# EasyEDA Pro project ProPrj_sx1262 125cm v0.2_2026-07-31.epro

# Schematic Schematic1
Board Name: Board1; Create Date: 2026-06-06; Page Name: P1; Project Name: sx1262 125cm; Schematic Name: Schematic1; Update Date: 2026-06-07; Company: EasyEDA.com; Page Size: A4; Version: V1.0
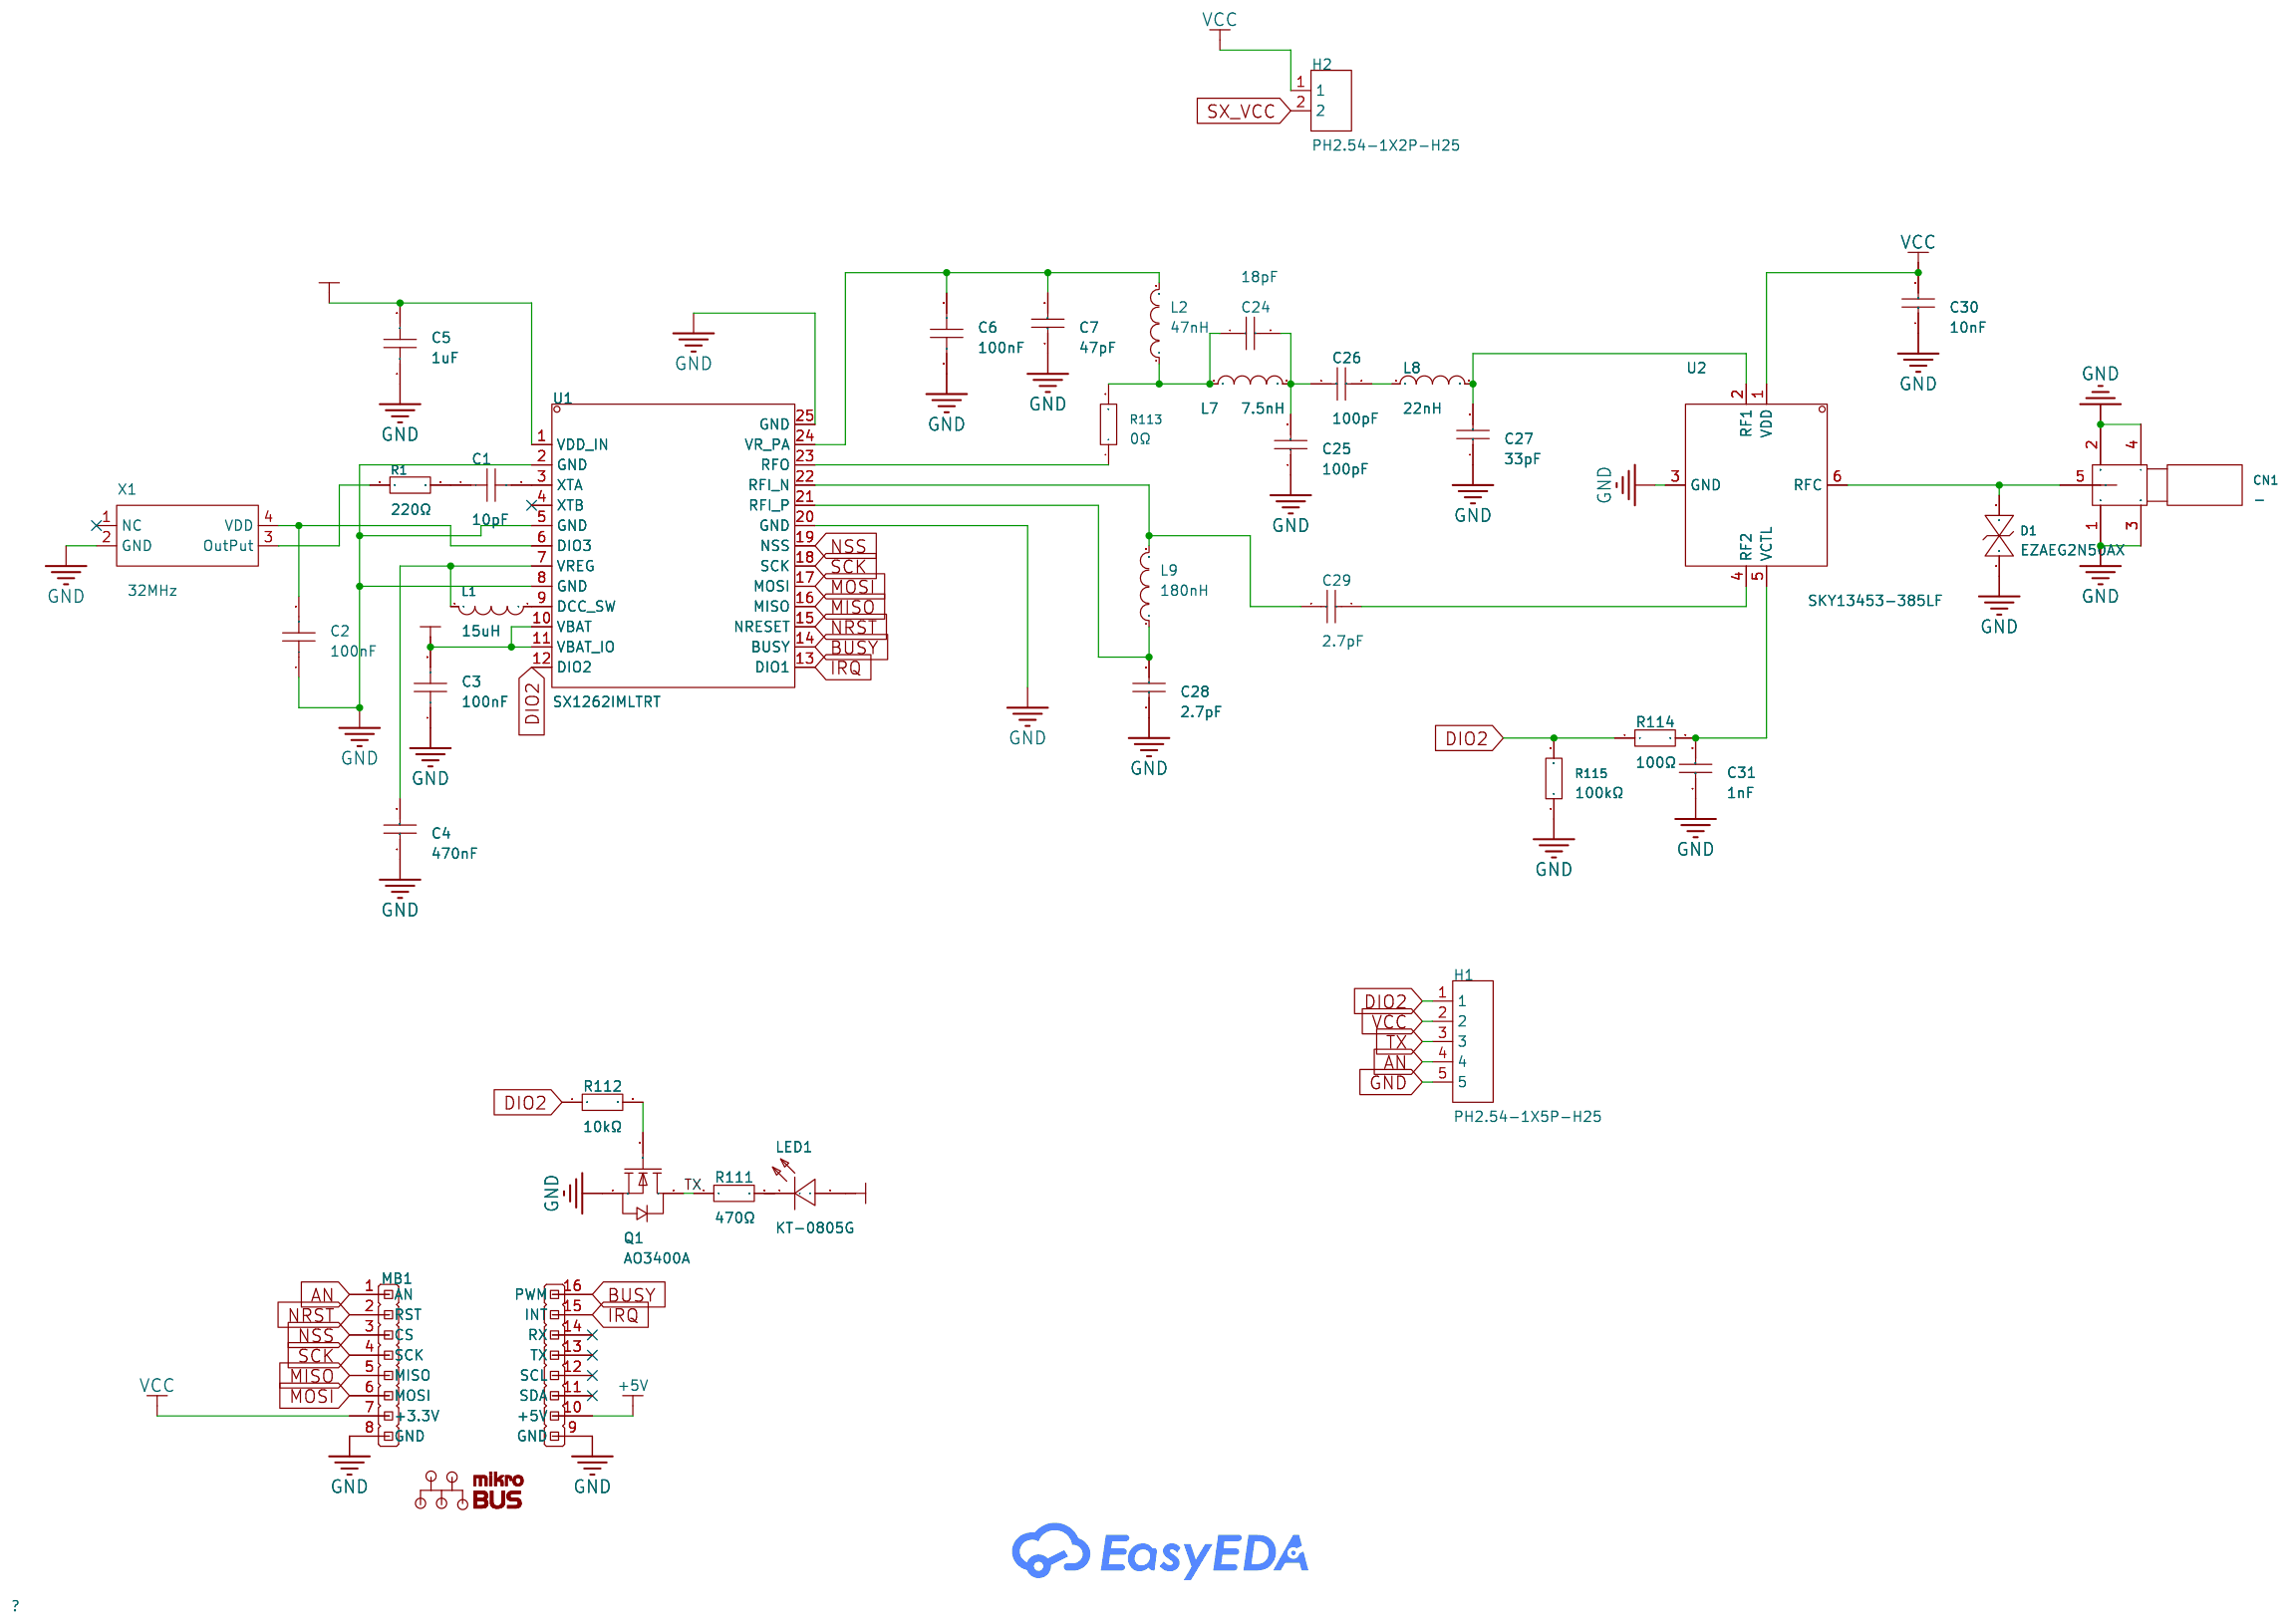
[diagram p0: schematic sheet]

## Parts
C1  10pF  [C0402]
C2  100nF  [C0402]
C3  100nF  [C0402]
C4  470nF  [C0603]
C5  1uF  [C0402]
C6  100nF  [C0402]
C7  47pF  [C0402]
C24  18pF  [C0402]
C25  100pF  [C0402]
C26  100pF  [C0402]
C27  33pF  [C0402]
C28  2.7pF  [C0402]
C29  2.7pF  [C0402]
C30  10nF  [C0402]
C31  1nF  [C0402]
CN1  -  [CONN-SMD_KH-SMA-KE8-G]
D1  EZAEG2N50AX  [D0402-BI]
H1  PH2.54-1X5P-H25  [HDR-TH_5P-P2.54-V-M-3]  (no BOM)
H2  PH2.54-1X2P-H25  [HDR-TH_2P-P2.54-V-M-4]  (no BOM)
L1  15uH  [L0805]
L2  47nH  [IND-SMD_L1.2-W0.6-1]
L7  7.5nH  [L0402]
L8  22nH  [L0402]
L9  180nH  [L0402-RD]
LED1  KT-0805G  [LED0805-R-RD]
MB1  -  [mikroBUS add-on Board]
Q1  AO3400A  [SOT-23-3_L2.9-W1.3-P1.90-LS2.4-BR]
R1  220Ω  [R0402]
R111  470Ω  [R0402]
R112  10kΩ  [R0402]
R113  0Ω  [R0402]
R114  100Ω  [R0402]
R115  100kΩ  [R0402]
U1  SX1262IMLTRT  [QFN-24_L4.0-W4.0-P0.50-BL-EP2.6]
U2  SKY13453-385LF  [QFN-6_L1.0-W1.0-P0.50-LS1.0-BL]
X1  32MHz  [OSC-SMD_4P-L2.0-W1.6-BL_1]

## Library data of the parts
C1 = CL05C100JB5NNNC: Capacitance:10pF Tolerance:±5% Tolerance:±5% Voltage Rating:50V Temperature Coefficient:C0G; LCSC Part Name: 10pF ±5% 50V; Supplier Part: C32949; Manufacturer: SAMSUNG(三星); Supplier Footprint: 0402; JLCPCB Part Class: Basic Part; Datasheet: https://item.szlcsc.com/datasheet/CL05C100JB5NNNC/33914.html; Supplier: LCSC; Tolerance: ±5%; Voltage Rating: 50V; Temperature Coefficient: C0G
C2 C3 C6 = CL05B104KO5NNNC: Capacitance:100nF Tolerance:±10% Tolerance:±10% Voltage Rating:16V Temperature Coefficient:X7R; LCSC Part Name: 100nF ±10% 16V; Supplier Part: C1525; Manufacturer: SAMSUNG(三星); Supplier Footprint: 0402; JLCPCB Part Class: Basic Part; Datasheet: https://item.szlcsc.com/datasheet/CL05B104KO5NNNC/1877.html; Supplier: LCSC; Tolerance: ±10%; Voltage Rating: 16V; Temperature Coefficient: X7R
C4 = CL10B474KA8NNNC: Capacitance:470nF Tolerance:±10% Tolerance:±10% Voltage Rating:25V Temperature Coefficient:X7R; LCSC Part Name: 470nF ±10% 25V; Supplier Part: C1623; Manufacturer: SAMSUNG(三星); Supplier Footprint: 0603; JLCPCB Part Class: Basic Part; Datasheet: https://item.szlcsc.com/datasheet/CL10B474KA8NNNC/1975.html; Supplier: LCSC; Tolerance: ±10%; Voltage Rating: 25V; Temperature Coefficient: X7R
C5 = CL05A105KA5NQNC: Capacitance:1uF Tolerance:±10% Tolerance:±10% Voltage Rating:25V Temperature Coefficient:X5R; LCSC Part Name: 1uF ±10% 25V; Supplier Part: C52923; Manufacturer: SAMSUNG(三星); Supplier Footprint: 0402; JLCPCB Part Class: Basic Part; Datasheet: https://item.szlcsc.com/datasheet/CL05A105KA5NQNC/53938.html; Supplier: LCSC; Tolerance: ±10%; Voltage Rating: 25V; Temperature Coefficient: X5R
C7 = 0402CG470J500NT: Capacitance:47pF Tolerance:±5% Tolerance:±5% Voltage Rating:50V Temperature Coefficient:C0G; LCSC Part Name: 47pF ±5% 50V; Supplier Part: C1567; Manufacturer: FH(风华); Supplier Footprint: 0402; JLCPCB Part Class: Basic Part; Datasheet: https://item.szlcsc.com/datasheet/0402CG470J500NT/1919.html; Supplier: LCSC; Tolerance: ±5%; Voltage Rating: 50V; Temperature Coefficient: C0G
C24 = 0402CG180J500NT: Capacitance:18pF Tolerance:±5% Tolerance:±5% Voltage Rating:50V Temperature Coefficient:C0G; LCSC Part Name: 18pF ±5% 50V; Supplier Part: C1549; Manufacturer: FH(风华); Supplier Footprint: 0402; JLCPCB Part Class: Basic Part; Datasheet: https://item.szlcsc.com/datasheet/0402CG180J500NT/1901.html; Supplier: LCSC; Tolerance: ±5%; Voltage Rating: 50V; Temperature Coefficient: C0G
C25 C26 = 0402CG101J500NT: Capacitance:100pF Tolerance:±5% Tolerance:±5% Voltage Rating:50V Temperature Coefficient:C0G; LCSC Part Name: 100pF ±5% 50V; Supplier Part: C1546; Manufacturer: FH(风华); Supplier Footprint: 0402; JLCPCB Part Class: Basic Part; Datasheet: https://item.szlcsc.com/datasheet/0402CG101J500NT/1898.html; Supplier: LCSC; Tolerance: ±5%; Voltage Rating: 50V; Temperature Coefficient: C0G
C27 = 0402CG330J500NT: Capacitance:33pF Tolerance:±5% Tolerance:±5% Voltage Rating:50V Temperature Coefficient:C0G; LCSC Part Name: 33pF ±5% 50V; Supplier Part: C1562; Manufacturer: FH(风华); Supplier Footprint: 0402; JLCPCB Part Class: Basic Part; Datasheet: https://item.szlcsc.com/datasheet/0402CG330J500NT/1914.html; Supplier: LCSC; Tolerance: ±5%; Voltage Rating: 50V; Temperature Coefficient: C0G
C28 C29 = 0402CG2R7C500NT: Capacitance:2.7pF Voltage Rating:50V Temperature Coefficient:C0G; LCSC Part Name: ±0.25pF 2.7pF 50V; Supplier Part: C1561; Manufacturer: FH(风华); Supplier Footprint: 0402; JLCPCB Part Class: Extended Part; Datasheet: https://item.szlcsc.com/datasheet/0402CG2R7C500NT/1913.html; Supplier: LCSC; Voltage Rating: 50V; Temperature Coefficient: C0G
C30 = CL05B103KB5NNNC: Capacitance:10nF Tolerance:±10% Tolerance:±10% Voltage Rating:50V Temperature Coefficient:X7R; LCSC Part Name: 10nF ±10% 50V; Supplier Part: C15195; Manufacturer: SAMSUNG(三星); Supplier Footprint: 0402; JLCPCB Part Class: Basic Part; Datasheet: https://item.szlcsc.com/datasheet/CL05B103KB5NNNC/15869.html; Supplier: LCSC; Tolerance: ±10%; Voltage Rating: 50V; Temperature Coefficient: X7R
C31 = 0402B102K500NT: Capacitance:1nF Tolerance:±10% Tolerance:±10% Voltage Rating:50V Temperature Coefficient:X7R; LCSC Part Name: 1nF ±10% 50V; Supplier Part: C1523; Manufacturer: FH(风华); Supplier Footprint: 0402; JLCPCB Part Class: Basic Part; Datasheet: https://item.szlcsc.com/datasheet/0402B102K500NT/1875.html; Supplier: LCSC; Tolerance: ±10%; Voltage Rating: 50V; Temperature Coefficient: X7R
CN1 = KH-SMA-KE8-G: Connector Type:Board Side Interface:Inner Bore Number of Ports:1 Interface Diameter:- Interface Length/Height:8mm Frequency:- RF Series:SMA Impedance:- Style:Offset Pin Operating Temperature Range:- Operating Temperature Range:-; LCSC Part Name: 内孔 SMA 偏脚; Supplier Part: C530661; Manufacturer: kinghelm(金航标); Supplier Footprint: 插件; JLCPCB Part Class: Extended Part; Datasheet: https://item.szlcsc.com/datasheet/KH-SMA-KE8-G/550995.html; Supplier: LCSC; Connector Type: Board Side; Interface: Inner Bore; Number of Ports: 1; Interface Length/Height: 8mm; RF Series: SMA; Style: Offset Pin
D1 = EZAEG2N50AX: Reverse Stand-Off Voltage (Vrwm):30V Clamping Voltage:100V Reverse Leakage Current (Ir):1mA Operating Temperature:-55℃~+125℃ Operating Temperature:-55℃~+125℃ level of protection:IEC 61000-4-2 Type:ESD Junction Capacitance:0.05pF; Supplier Part: C543662; Manufacturer: PANASONIC(松下); Supplier Footprint: 0402; JLCPCB Part Class: Extended Part; Datasheet: https://item.szlcsc.com/datasheet/EZAEG2N50AX/564298.html; Supplier: LCSC; Reverse Stand-Off Voltage (Vrwm): 30V; Clamping Voltage: 100V; Reverse Leakage Current (Ir): 1mA; Operating Temperature: -55℃~+125℃; level of protection: IEC 61000-4-2; Type: ESD; Junction Capacitance: 0.05pF
H1 = PH2.54-1X5P-H25: Pin Structure:1x5P Pitch:2.54mm Row Spacing:- Circluar Pins/Square Pins:Pin Header Mounting Type:Through Hole Number of Rows:1 Number of Pins:5P Current Rating:3A Voltage Rating (Max):- Length of Mating Pin:6mm Insulation Height:2.5mm Length of End Connec; LCSC Part Name: 1x5P 间距:2.54mm 方针 直插; Supplier Part: C42431835; Manufacturer: JXTCONN(聚兴泰); Supplier Footprint: 插件,P=2.54mm; JLCPCB Part Class: Extended Part; Datasheet: https://item.szlcsc.com/datasheet/PH2.54-1X5P-H25/44458965.html; Supplier: LCSC; Pin Structure: 1x5P; Pitch: 2.54mm; Circluar Pins/Square Pins: Pin Header; Mounting Type: Through Hole; Number of Rows: 1; Number of Pins: 5P; Current Rating: 3A; Length of Mating Pin: 6mm; Insulation Height: 2.5mm; Length of End Connection Pin: 3mm; Contact Material: Brass; Contact Plating: Gold; Operating Temperature: -40℃~+105℃; Color: Black
H2 = PH2.54-1X2P-H25: Pin Structure:1x2P Pitch:2.54mm Row Spacing:- Circluar Pins/Square Pins:Pin Header Mounting Type:Through Hole Number of Rows:1 Number of Pins:2P Current Rating:3A Voltage Rating (Max):- Length of Mating Pin:6mm Insulation Height:2.5mm Length of End Connec; LCSC Part Name: 1x2P 间距:2.54mm 方针 直插; Supplier Part: C42431798; Manufacturer: JXTCONN(聚兴泰); Supplier Footprint: 插件,P=2.54mm; JLCPCB Part Class: Extended Part; Datasheet: https://item.szlcsc.com/datasheet/PH2.54-1X2P-H25/44458928.html; Supplier: LCSC; Pin Structure: 1x2P; Pitch: 2.54mm; Circluar Pins/Square Pins: Pin Header; Mounting Type: Through Hole; Number of Rows: 1; Number of Pins: 2P; Current Rating: 3A; Length of Mating Pin: 6mm; Insulation Height: 2.5mm; Length of End Connection Pin: 3mm; Contact Material: Brass; Contact Plating: Gold; Operating Temperature: -40℃~+105℃; Color: Black
L1 = MLZ2012M150WT000: Inductance:15uH Tolerance:±20% Tolerance:±20% Current Rating:- Current - Saturation (Isat):120mA DC Resistance(DCR):950mΩ Q @ Frequency:- Frequency - Self Resonant:2MHz Ratings:-; LCSC Part Name: 15uH ±20% 120mA; Supplier Part: C383402; Manufacturer: TDK; Supplier Footprint: 0805; JLCPCB Part Class: Extended Part; Datasheet: https://item.szlcsc.com/datasheet/MLZ2012M150WT000/356709.html; Supplier: LCSC; Tolerance: ±20%; Current - Saturation (Isat): 120mA; DC Resistance(DCR): 950mΩ; Frequency - Self Resonant: 2MHz
L2 = SCW1005C47NJST: Inductance:47nH Tolerance:±5% Tolerance:±5% Current Rating:200mA Current - Saturation (Isat):- DC Resistance(DCR):950mΩ Q @ Frequency:25@250MHz Frequency - Self Resonant:2.9GHz Ratings:- Type:Wire-wound chip inductor; LCSC Part Name: 47nH ±5%; Supplier Part: C330871; Manufacturer: Sunltech(顺磁); Supplier Footprint: 0402; JLCPCB Part Class: Extended Part; Datasheet: https://item.szlcsc.com/datasheet/SCW1005C47NJST/310273.html; Supplier: LCSC; Tolerance: ±5%; Current Rating: 200mA; DC Resistance(DCR): 950mΩ; Q @ Frequency: 25@250MHz; Frequency - Self Resonant: 2.9GHz; Type: Wire-wound chip inductor
L7 = LQG15HS7N5J02D: Inductance:7.5nH Tolerance:±5% Tolerance:±5% Current Rating:550mA Current - Saturation (Isat):- DC Resistance(DCR):240mΩ Q @ Frequency:8@100MHz Frequency - Self Resonant:4.2GHz Ratings:-; LCSC Part Name: 7.5nH ±5%; Supplier Part: C98001; Manufacturer: muRata(村田); Supplier Footprint: 0402; JLCPCB Part Class: Extended Part; Datasheet: https://item.szlcsc.com/datasheet/LQG15HS7N5J02D/99210.html; Supplier: LCSC; Tolerance: ±5%; Current Rating: 550mA; DC Resistance(DCR): 240mΩ; Q @ Frequency: 8@100MHz; Frequency - Self Resonant: 4.2GHz
L8 = SCW1005C22NJST: Inductance:22nH Tolerance:±5% Tolerance:±5% Current Rating:330mA Current - Saturation (Isat):- DC Resistance(DCR):360mΩ Q @ Frequency:25@250MHz Frequency - Self Resonant:4GHz Ratings:- Type:Wire-wound chip inductor; LCSC Part Name: 22nH ±5%; Supplier Part: C330861; Manufacturer: Sunltech(顺磁); Supplier Footprint: 0402; JLCPCB Part Class: Extended Part; Datasheet: https://item.szlcsc.com/datasheet/SCW1005C22NJST/310263.html; Supplier: LCSC; Tolerance: ±5%; Current Rating: 330mA; DC Resistance(DCR): 360mΩ; Q @ Frequency: 25@250MHz; Frequency - Self Resonant: 4GHz; Type: Wire-wound chip inductor
L9 = MLG1005SR18JTD25: Inductance: Tolerance:±5% Tolerance:±5% Rated Current: Saturation Current (Isat):- DC Resistance (DCR): Q @ Freq:8@100MHz Frequency - Self Resonant: Ratings:AEC-Q200; LCSC Part Name: 180nH ±5%; Supplier Part: C694570; Manufacturer: TDK; Supplier Footprint: 0402; JLCPCB Part Class: Extended Part; Datasheet: https://atta.szlcsc.com/upload/public/pdf/source/20210429/EF7AC43F62BD048FB58613B8084F8FDA.pdf; Supplier: LCSC; Tolerance: ±5%; Q @ Freq: 8@100MHz; Ratings: AEC-Q200
LED1 = KT-0805G: Lamp Holder Type:- Illumination Color:Emerald Green Voltage - Forward(Vf):2.6V~3.1V Voltage - Forward(Vf):2.6V~3.1V Power(Watts):100mW Forward Current:5mA Wavelength - Dominant:513nm~528nm Wavelength - Dominant:513nm~528nm Peak Wavelength:525nm Diode Conf; LCSC Part Name: 0805 翠绿 高亮; Supplier Part: C2297; Manufacturer: KENTO; Supplier Footprint: 0805; JLCPCB Part Class: Basic Part; Datasheet: https://item.szlcsc.com/datasheet/KT-0805G/2670.html; Supplier: LCSC; Illumination Color: Emerald Green; Voltage - Forward(Vf): 2.6V~3.1V; Power(Watts): 100mW; Forward Current: 5mA; Wavelength - Dominant: 513nm~528nm; Peak Wavelength: 525nm; Diode Configuration: Discrete Diode; Lens Color: Water Clear; Luminous Intensity: 430mcd; Viewing Angle: 120°; Operating Temperature: -40℃~+85℃
MB1 = mikroBUS: ClickBoard
Q1 = AO3400A_C20917: Number:- Drain to Source Voltage:30V Current - Continuous Drain(Id):- RDS(on):48mΩ@2.5V Pd - Power Dissipation:- Gate Threshold Voltage (Vgs(th)):1.45V@250uA Gate Charge(Qg):7nC@10V Input Capacitance(Ciss):630pF@15V Reverse Transfer Capacitance (Crss@Vds); LCSC Part Name: 1个N沟道 耐压:30V 电流:5.7A; Supplier Part: C20917; Manufacturer: AOS; Supplier Footprint: SOT-23-3L; JLCPCB Part Class: Basic Part; Datasheet: https://item.szlcsc.com/datasheet/AO3400A/21629.html; Supplier: LCSC; Drain to Source Voltage: 30V; RDS(on): 48mΩ@2.5V; Gate Threshold Voltage (Vgs(th)): 1.45V@250uA; Gate Charge(Qg): 7nC@10V; Input Capacitance(Ciss): 630pF@15V; Operating Temperature: -55℃~+150℃@(Tj); Type: N-Channel
R1 = 0402WGF2200TCE: Type:Thick Film Resistor Resistance:220Ω Tolerance:±1% Tolerance:±1% Power(Watts):62.5mW Voltage-Supply(Max):50V Temperature Coefficient:±100ppm/℃ Temperature Coefficient:±100ppm/℃ Operating Temperature:-55℃~+155℃ Operating Temperature:-55℃~+155℃; LCSC Part Name: 220Ω ±1% 62.5mW 厚膜电阻; Supplier Part: C25091; Manufacturer: UNI-ROYAL(厚声); Supplier Footprint: 0402; JLCPCB Part Class: Basic Part; Datasheet: https://item.szlcsc.com/datasheet/0402WGF2200TCE/25834.html; Supplier: LCSC; Type: Thick Film Resistor; Tolerance: ±1%; Power(Watts): 62.5mW; Voltage-Supply(Max): 50V; Temperature Coefficient: ±100ppm/℃; Operating Temperature: -55℃~+155℃
R111 = 0402WGF4700TCE: Type:Thick Film Resistor Resistance:470Ω Tolerance:±1% Tolerance:±1% Power(Watts):62.5mW Voltage-Supply(Max):50V Temperature Coefficient:±100ppm/℃ Temperature Coefficient:±100ppm/℃ Operating Temperature:-55℃~+155℃ Operating Temperature:-55℃~+155℃; LCSC Part Name: 470Ω ±1% 62.5mW 厚膜电阻; Supplier Part: C25117; Manufacturer: UNI-ROYAL(厚声); Supplier Footprint: 0402; JLCPCB Part Class: Basic Part; Datasheet: https://item.szlcsc.com/datasheet/0402WGF4700TCE/25860.html; Supplier: LCSC; Type: Thick Film Resistor; Tolerance: ±1%; Power(Watts): 62.5mW; Voltage-Supply(Max): 50V; Temperature Coefficient: ±100ppm/℃; Operating Temperature: -55℃~+155℃
R112 = 0402WGF1002TCE: Type:Thick Film Resistor Resistance:10kΩ Tolerance:±1% Tolerance:±1% Power(Watts):62.5mW Voltage-Supply(Max):50V Temperature Coefficient:±100ppm/℃ Temperature Coefficient:±100ppm/℃ Operating Temperature:-55℃~+155℃ Operating Temperature:-55℃~+155℃; LCSC Part Name: 10kΩ ±1% 62.5mW 厚膜电阻; Supplier Part: C25744; Manufacturer: UNI-ROYAL(厚声); Supplier Footprint: 0402; JLCPCB Part Class: Basic Part; Datasheet: https://item.szlcsc.com/datasheet/0402WGF1002TCE/26487.html; Supplier: LCSC; Type: Thick Film Resistor; Tolerance: ±1%; Power(Watts): 62.5mW; Voltage-Supply(Max): 50V; Temperature Coefficient: ±100ppm/℃; Operating Temperature: -55℃~+155℃
R113 = 0402WGF0000TCE: Type:Thick Film Resistor Resistance:0Ω Tolerance:±1% Tolerance:±1% Power(Watts):62.5mW Voltage-Supply(Max):50V Temperature Coefficient:±800ppm/℃ Temperature Coefficient:±800ppm/℃ Operating Temperature:-55℃~+155℃ Operating Temperature:-55℃~+155℃; LCSC Part Name: 0Ω ±1% 62.5mW 厚膜电阻; Supplier Part: C17168; Manufacturer: UNI-ROYAL(厚声); Supplier Footprint: 0402; JLCPCB Part Class: Basic Part; Datasheet: https://item.szlcsc.com/datasheet/0402WGF0000TCE/17853.html; Supplier: LCSC; Type: Thick Film Resistor; Tolerance: ±1%; Power(Watts): 62.5mW; Voltage-Supply(Max): 50V; Temperature Coefficient: ±800ppm/℃; Operating Temperature: -55℃~+155℃
R114 = 0402WGF1000TCE: Type:Thick Film Resistors Resistance: Tolerance:±1% Tolerance:±1% Power(Watts): Overload Voltage (Max): Temperature Coefficient:±200ppm/℃ Temperature Coefficient:±200ppm/℃ Operating Temperature Range:-55℃~+155℃ Operating Temperature Range:-55℃~+155℃; LCSC Part Name: 100Ω ±1% 62.5mW 厚膜电阻; Supplier Part: C25076; Manufacturer: UNI-ROYAL(厚声); Supplier Footprint: 0402; JLCPCB Part Class: Basic Part; Datasheet: https://atta.szlcsc.com/upload/public/pdf/source/20200306/C422600_1E6D84923E4A46A82E41ADD87F860B5C.pdf; Supplier: LCSC; Type: Thick Film Resistors; Tolerance: ±1%; Temperature Coefficient: ±200ppm/℃; Operating Temperature Range: -55℃~+155℃
R115 = 0402WGF1003TCE: Type:Thick Film Resistor Resistance:100kΩ Tolerance:±1% Tolerance:±1% Power(Watts):62.5mW Voltage-Supply(Max):50V Temperature Coefficient:±100ppm/℃ Temperature Coefficient:±100ppm/℃ Operating Temperature:-55℃~+155℃ Operating Temperature:-55℃~+155℃; LCSC Part Name: 100kΩ ±1% 62.5mW 厚膜电阻; Supplier Part: C25741; Manufacturer: UNI-ROYAL(厚声); Supplier Footprint: 0402; JLCPCB Part Class: Basic Part; Datasheet: https://item.szlcsc.com/datasheet/0402WGF1003TCE/26484.html; Supplier: LCSC; Type: Thick Film Resistor; Tolerance: ±1%; Power(Watts): 62.5mW; Voltage-Supply(Max): 50V; Temperature Coefficient: ±100ppm/℃; Operating Temperature: -55℃~+155℃
U1 = SX1262IMLTRT: Frequency Range:- Frequency Range:- Interface:SPI Voltage - Supply:1.8V~3.7V Voltage - Supply:1.8V~3.7V Applications:General-purposeISM Output Power:22dBm Data Rate:300Kbps Current Of Transmitting:32mA Sensitivity:-148dBm Receive Current:4.2mA Operating T; Supplier Part: C191341; Manufacturer: SEMTECH; Supplier Footprint: QFN-24-EP(4x4); JLCPCB Part Class: Extended Part; Datasheet: https://item.szlcsc.com/datasheet/SX1262IMLTRT/216566.html; Supplier: LCSC; Interface: SPI; Voltage - Supply: 1.8V~3.7V; Applications: General-purposeISM; Output Power: 22dBm; Data Rate: 300Kbps; Current Of Transmitting: 32mA; Sensitivity: -148dBm; Receive Current: 4.2mA; Operating Temperature: -40℃~+85℃
U2 = SKY13453-385LF: Circuit:SPDT Frequency range:10MHz~6GHz Frequency range:10MHz~6GHz isolation:27dB Insertion loss:0.4dB P1dB:- Voltage - Supply:2.5V~3.5V Voltage - Supply:2.5V~3.5V operating temperature:-40℃~+90℃ operating temperature:-40℃~+90℃ Features:Integrated control; LCSC Part Name: 0.01至6.0GHz单控制SPDT射频开关; Supplier Part: C150878; Manufacturer: SKYWORKS; Supplier Footprint: QFN-6(1x1); JLCPCB Part Class: Extended Part; Datasheet: https://item.szlcsc.com/datasheet/SKY13453-385LF/162218.html; Supplier: LCSC; Circuit: SPDT; Frequency range: 10MHz~6GHz; isolation: 27dB; Insertion loss: 0.4dB; Voltage - Supply: 2.5V~3.5V; operating temperature: -40℃~+90℃; Features: Integrated control logic
X1 = OW7EL89CANUXK7YLC-32M: Frequency:32MHz Frequency Stability:±500ppb Frequency Stability:±500ppb Output Type:Clipped sine wave Voltage - Supply:1.8V Voltage - Supply:1.8V Current - Supply:- Operating Temperature:-30℃~+85℃ Operating Temperature:-30℃~+85℃ Ratings:-; LCSC Part Name: YSO510TP 32MHZ 1.8V ±1.5PPM -30~85℃ (±0.5PPM) Clipped Sine Wave; Supplier Part: C48332759; Manufacturer: YXC(扬兴晶振); Supplier Footprint: SMD2016-4P; JLCPCB Part Class: Extended Part; Datasheet: https://item.szlcsc.com/datasheet/OW7EL89CANUXK7YLC-32M/50580117.html; Supplier: LCSC; Frequency Stability: ±500ppb; Output Type: Clipped sine wave; Voltage - Supply: 1.8V; Operating Temperature: -30℃~+85℃

## Nets
+5V: MB1.10(+5V)
GND: C2.1 C3.1 C4.1 C5.1 C6.1 C7.1 C25.1 C27.1 C28.1 C30.1 C31.1 CN1.1 CN1.2 CN1.3 CN1.4 D1.1 H1.5 MB1.8(GND) MB1.9(GND) Q1.2(S) R115.1 U1.2(GND) U1.5(GND) U1.8(GND) U1.20(GND) U1.25(GND) U2.3(GND) X1.2(GND)
VCC: C30.2 H1.2 H2.1 LED1.1(A) MB1.7(+3.3V) U2.1(VDD)
AN: H1.4 MB1.1(AN)
BUSY: MB1.16(PWM) U1.14(BUSY)
DIO2: H1.1 R112.1 R114.1 R115.2 U1.12(DIO2)
IRQ: MB1.15(INT) U1.13(DIO1)
MISO: MB1.5(MISO) U1.16(MISO)
MOSI: MB1.6(MOSI) U1.17(MOSI)
NRST: MB1.2(RST) U1.15(NRESET)
NSS: MB1.3(CS) U1.19(NSS)
SCK: MB1.4(SCK) U1.18(SCK)
SX_VCC: C3.2 C5.2 H2.2 U1.1(VDD_IN) U1.10(VBAT) U1.11(VBAT_IO)
TX: H1.3 Q1.3(D) R111.1
$1N896: C1.2 U1.3(XTA)
$1N969: C1.1 R1.2
$1N1011: C2.2 U1.6(DIO3) X1.4(VDD)
$1N1017: R1.1 X1.3(OutPut)
$1N1388: C4.2 L1.2 U1.7(VREG)
$1N1396: L1.1 U1.9(DCC_SW)
$1N1923: C6.2 C7.2 L2.2 U1.24(VR_PA)
$1N2924: C29.2 L9.2 U1.22(RFI_N)
$1N3047: C28.2 L9.1 U1.21(RFI_P)
$1N4328: LED1.2(K) R111.2
$1N4330: Q1.1(G) R112.2
$1N8839: R113.1 U1.23(RFO)
$1N8844: C24.1 L2.1 L7.1 R113.2
$1N12166: C24.2 C25.2 C26.1 L7.2
$1N12308: C26.2 L8.1
$1N12515: CN1.5 D1.2 U2.6(RFC)
$1N13592: C31.2 R114.2 U2.5(VCTL)
$1N13617: C27.2 L8.2 U2.2(RF1)
$1N13621: C29.1 U2.4(RF2)

Not connected (* = marked no-connect by the designer): MB1 11(SDA)* 12(SCL)* 13(TX)* 14(RX)*; U1 4(XTB)*; X1 1(NC)*

# Board PCB1
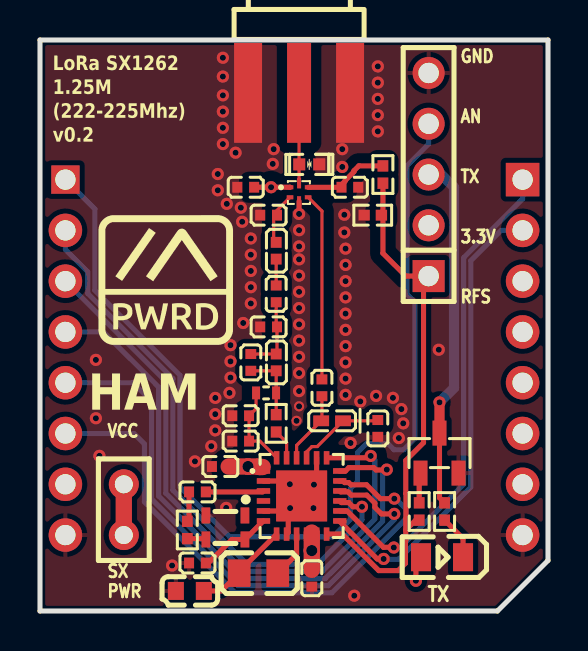
[diagram p1: board, top side]
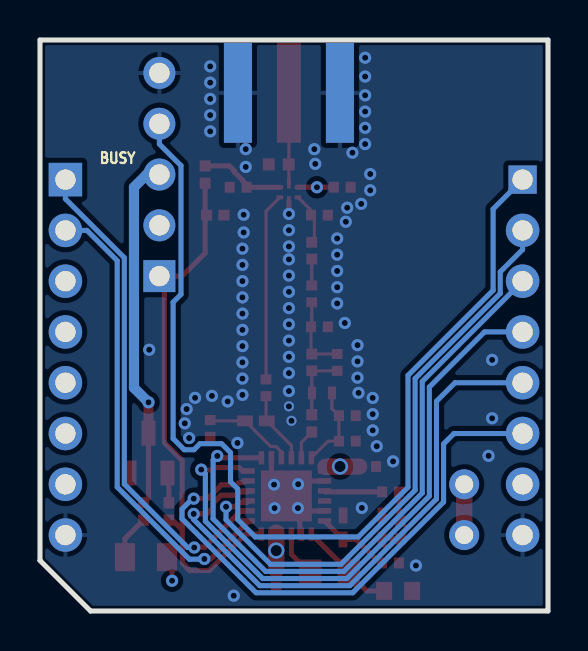
[diagram p2: board, bottom side, seen from below]

Outline 25.4 x 28.56 mm; copper layers: Top Layer, Inner1, Inner2, Bottom Layer. Coordinates in mm from the lower left corner of the outline.
Outline path: 0,28.56 25.4,28.56 25.4,2.53 22.87,0 0,0 0,28.56
Stack: Top Layer 0.035mm Outer layer thickness 1oz / Dielectric1 0.2104mm 7628 RC49% 8.6mil / Inner1 0.0152mm Inner layer thickness / Dielectric2 1.065mm 1.1mm H/HOZ Copper / Inner2 0.0152mm Inner layer thickness / Dielectric3 0.2104mm 7628 RC49% 8.6mil / Bottom Layer 0.035mm Outer layer thickness 1oz

## Design rules (mm)
template: Custom Config
spacing copperThickness1oz (default): track to track 0.102, other pairs 0.152 to 0.3
spacing copperThickness2oz: track to track 0.203, other pairs 0.152 to 0.3
spacing safeClearance1: track to track 0.152, other pairs 0.152 to 0.508
track width copperThickness1oz (default): min 0.127, default 0.254, max 2.54
track width copperThickness2oz: min 0.203, default 0.254, max 2.54
differential pair differentialPair (default): width min 0.127, default 0.254, max 2.54; gap min 0.152, default 0.152
via viaSize (default): diameter min 0.5, default 0.61, max 10; hole min 0.3, default 0.305, max 6.3
region e1463 uses copperRegion1, safeClearance1

## Placement (name value [footprint] x y rotation side)
C1  10pF  [C0402]  7.87 5.96 0 top
C2  100nF  [C0402]  7.87 2.4 0 top
C3  100nF  [C0402]  13.59 1.64 90 top
C4  470nF  [C0603]  7.49 1.01 0 top
C5  1uF  [C0402]  9.02 7.23 0 top
C6  100nF  [C0402]  10.03 9.77 0 top
C7  47pF  [C0402]  10.03 8.5 0 top
C24  18pF  [C0402]  10.54 12.44 90 top
C25  100pF  [C0402]  11.43 14.21 0 top
C26  100pF  [C0402]  11.81 15.86 90 top
C27  33pF  [C0402]  11.43 19.8 0 top
C28  2.7pF  [C0402]  16.89 9.13 90 top
C29  2.7pF  [C0402]  14.1 11.17 270 top
C30  10nF  [C0402]  10.29 21.2 0 top
C31  1nF  [C0402]  15.49 21.2 180 top
CN1  -  [CONN-SMD_KH-SMA-KE8-G]  12.95 25.92 0 top
D1  EZAEG2N50AX  [D0402-BI]  13.46 22.34 180 top
H1  PH2.54-1X5P-H25  [HDR-TH_5P-P2.54-V-M-3]  19.43 21.83 90 top
H2  PH2.54-1X2P-H25  [HDR-TH_2P-P2.54-V-M-4]  4.19 5.07 270 top
L1  15uH  [L0805]  10.92 1.89 180 top
L2  47nH  [IND-SMD_L1.2-W0.6-1]  11.3 10.91 180 top
L7  7.5nH  [L0402]  11.81 12.44 90 top
L8  22nH  [L0402]  11.81 18.02 90 top
L9  180nH  [L0402-RD]  14.6 9.51 180 top
LED1  KT-0805G  [LED0805-R-RD]  20.1 2.69 180 top
MB1  -  [mikroBUS add-on Board]  12.7 12.69 0 top
Q1  AO3400A  [SOT-23-3_L2.9-W1.3-P1.90-LS2.4-BR]  19.97 7.9 270 top
R1  220Ω  [R0402]  7.37 4.05 90 top
R111  470Ω  [R0402]  20.23 4.98 270 top
R112  10kΩ  [R0402]  18.96 4.98 90 top
R113  0Ω  [R0402]  11.81 9.39 90 top
R114  100Ω  [R0402]  17.15 21.83 90 top
R115  100kΩ  [R0402]  16.64 19.8 0 top
U1  SX1262IMLTRT  [QFN-24_L4.0-W4.0-P0.50-BL-EP2.6]  13.08 5.76 270 top
U2  SKY13453-385LF  [QFN-6_L1.0-W1.0-P0.50-LS1.0-BL]  12.95 20.94 270 top
X1  32MHz  [OSC-SMD_4P-L2.0-W1.6-BL_1]  9.27 4.18 180 top

## Footprints (pads in the part's own frame, mm; a bottom-side part is the same pattern mirrored in y, then rotated)
C0402
  rect 0.5x0.54 smd: 1(-0.42,0) 2(0.42,0)
C0603
  rect 0.8x0.9 smd: 1(-0.7,0) 2(0.7,0)
CONN-SMD_KH-SMA-KE8-G
  rect 1.4x5 smd: 1(-2.55,0) 2(2.55,0)
  rect 1.4x5 smd far side: 3(-2.55,0) 4(2.55,0)
  rect 1.2x5 smd: 5(0,0)
D0402-BI
  rect 0.6x0.6 smd: 1(-0.5,0) 2(0.5,0)
HDR-TH_2P-P2.54-V-M-4
  round 1.5 hole 0.9: 1(-1.27,0) 2(1.27,0)
HDR-TH_5P-P2.54-V-M-3
  rect 1.6x1.6 hole 1.02: 1(-5.08,0)
  round 1.6 hole 1.02: 2(-2.54,0) 3(0,0) 4(2.54,0) 5(5.08,0)
IND-SMD_L1.2-W0.6-1
  rect 0.4x0.64 smd: 1(-0.5,0) 2(0.5,0)
L0402
  rect 0.54x0.54 smd: 1(-0.42,0) 2(0.42,0)
L0402-RD
  rect 0.79x0.54 smd: 1(-0.545,0) 2(0.545,0)
L0805
  rect 1.133x1.377 smd: 1(-0.966,0) 2(0.966,0)
LED0805-R-RD
  rect 1x1.399 smd: 1(1.05,0) 2(-1.05,0)
mikroBUS add-on Board
  rect 1.415x1.415 hole 1.016: 1(-11.429,8.89)
  round 1.677 hole 1.016: 2(-11.43,6.35) 3(-11.43,3.81) 4(-11.43,1.27) 5(-11.43,-1.27) 6(-11.43,-3.81) 7(-11.43,-6.35) 8(-11.43,-8.89) 9(11.43,-8.89) 10(11.43,-6.35) 11(11.43,-3.81) 12(11.43,-1.27) 13(11.43,1.27) 14(11.43,3.81) 15(11.43,6.35)
  rect 1.677x1.677 hole 1.016: 16(11.43,8.89)
OSC-SMD_4P-L2.0-W1.6-BL_1
  rect 0.44x0.8 smd: 1(-0.975,-0.6) 2(0.975,-0.6) 3(0.975,0.6) 4(-0.975,0.6)
QFN-6_L1.0-W1.0-P0.50-LS1.0-BL
  rect 0.2x0.33 smd: 1(-0.25,-0.453) 2(0.25,-0.453) 4(0.25,0.453) 5(-0.25,0.453)
  rect 0.51x0.2 smd: 3(0.453,0) 6(-0.453,0)
QFN-24_L4.0-W4.0-P0.50-BL-EP2.6
  rect 0.28x0.665 smd: 1(-1.25,-1.907) 2(-0.75,-1.907) 3(-0.25,-1.907) 4(0.25,-1.907) 5(0.75,-1.907) 6(1.25,-1.907) 13(1.25,1.907) 14(0.75,1.907) 15(0.25,1.907) 16(-0.25,1.907) 17(-0.75,1.907) 18(-1.25,1.907)
  rect 0.665x0.28 smd: 7(1.907,-1.25) 8(1.907,-0.75) 9(1.907,-0.25) 10(1.907,0.25) 11(1.907,0.75) 12(1.907,1.25) 19(-1.907,1.25) 20(-1.907,0.75) 21(-1.907,0.25) 22(-1.907,-0.25) 23(-1.907,-0.75) 24(-1.907,-1.25)
  rect 2.55x2.55 smd: 25(0,0)
R0402
  rect 0.566x0.54 smd: 1(-0.433,0) 2(0.433,0)
SOT-23-3_L2.9-W1.3-P1.90-LS2.4-BR
  rect 1.25x0.7 smd: 1(1,-0.95) 2(1,0.95) 3(-1,0)

## Nets
As in the schematic.

Pads without a net: MB1 11 12 13 14; U1 4; X1 1

## Via types
v1: diameter 0.61, hole 0.305, Top Layer to Bottom Layer, 88 vias
v2: diameter 0.508, hole 0.305, Top Layer to Bottom Layer, 2 vias
v3: diameter 0.813, hole 0.559, Top Layer to Bottom Layer, 2 vias

## Routing (per net, layer and track width the routed paths; a pad name or vN(x,y) marks a point on that pad's centre or on a via; arc(x,y) is an arc through that point)
GND: length 7.7
  Top Layer w0.254: v1(12.5,5.15) 12.41,5.05 ; 12.41,5.05 12.36,5 11.17,5 ; 12.41,5.05 12.41,3.93 U1.8 ; U1.20 13.83,6.84 13.7,6.7 v1(13.7,6.32) 13.13,5.76 U1.25 12.33,6.51 U1.2 ; v1(12.95,19.86) U2.3
  vias: v1(2.79,12.56) v1(2.79,9.64) v1(2.97,7.76) v1(6.6,2.28) v1(7.75,7.49) v1(8.56,8.24) v1(8.77,10.66) v1(8.76,9.85) v1(8.76,9.04) v1(8.89,21.86) v1(8.89,21.05) v1(9.14,27.68) v1(9.14,26.74) v1(9.14,25.8) v1(9.14,24.98) v1(9.14,24.17) v1(9.14,23.36) v1(9.34,20.37) v1(9.31,5.16) v1(9.53,13.3) v1(9.53,12.49) v1(9.53,11.67) v1(9.47,10.91) v1(9.78,22.93) v1(10.04,20.17) v1(10.11,19.47) v1(10.16,14.41) v1(10.54,18.64) v1(10.54,17.82) v1(10.54,17.01) v1(10.54,16.2) v1(10.54,15.39) v1(11.64,22.37) v1(11.68,23.1) v1(12.49,6.34) v1(12.95,19.05) v1(12.95,18.24) v1(12.95,17.59) v1(12.95,16.78) v1(12.95,15.97) v1(12.95,15.15) v1(12.95,14.34) v1(12.95,13.53) v1(12.95,12.72) v1(12.95,11.9) v1(12.95,11) v1(13.67,5.15) v1(15.11,23.1) v1(15.11,22.21) v1(15.22,19.82) v1(15.22,18.94) v1(15.28,18.13) v1(15.28,17.31) v1(15.28,16.5) v1(15.28,15.69) v1(15.28,14.88) v1(15.28,14.06) v1(15.28,13.25) v1(15.28,12.44) v1(15.28,11.62) v1(15.28,10.81) v1(15.53,8.41) v1(15.71,0.77) v1(16.02,10.48) v1(16.81,10.76) v1(16.89,27.24) v1(16.89,26.43) v1(16.89,25.62) v1(16.89,24.81) v1(16.89,23.99) v1(17.65,10.66) v1(17.94,8.65) v1(18.07,10.1) v1(18.16,9.39) v1(19.94,13.07) v2(12.83,9.51) v2(12.95,10.24)
VCC: length 19.3
  Top Layer w0.254: U2.1 12.5,21.2 v1(11.55,21.2) C30.2 ; v1(18.8,1.51) 18.8,2.44 LED1.1
  Top Layer w0.813: 4.19,6.03 4.19,4.29
  Inner2 w1.524: 4.19,17.9 H2.1 MB1.7
AN: length 50.9
  Bottom Layer w0.254: H1.4 19.43,23.36 18.35,22.28 18.35,15.84 18.75,15.44 18.75,8.63 18.19,8.07 17.7,8.07 17.4,8.37 16.32,8.37 15.88,7.92 15.88,6.47 15.51,6.11 15.51,4.58 14.64,3.71 9.49,3.71 7,6.19 7,11.79 2.74,16.04 2.74,20.11 MB1.1
BUSY: length 24.7
  Top Layer w0.254: 14.99,5 15.36,5 17.17,3.19 17.63,3.19 17.64,3.18 v1(17.69,3.18)
  Bottom Layer w0.254: v1(17.69,3.18) 18.01,3.18 21.18,6.35 21.18,17.67 24.13,20.62 MB1.16
DIO2: length 27.3
  Top Layer w0.254: R114.1 17.15,19.88 ; 17.15,19.88 17.15,17.9 18.29,16.75 H1.1 ; 17.15,19.88 R115.2 ; H1.1 19.81,16.75 ; H1.1 19.18,16.5 19.18,8.42 18.29,7.53 18.29,5.87 18.3,5.86 18.3,4.62 18.29,4.61 18.29,4.05 ; 18.29,4.05 18.29,3.52 18.27,3.51 18.27,2.39 17.91,2.02 16.94,2.02 15.11,3.85 U1.12 ; 18.29,4.05 18.78,4.55 R112.1
IRQ: length 23.6
  Top Layer w0.254: U1.13 14.99,4.48 16.86,2.61 v1(17.18,2.61)
  Bottom Layer w0.254: 17.31,2.73 v1(17.18,2.61) 17.43,2.61 17.45,2.59 17.93,2.59 21.54,6.2 21.54,17.53 23.05,19.04 MB1.15
MISO: length 28.5
  Top Layer w0.254: 14.99,6 15.04,5.96 15.41,5.96 15.57,5.8 16.34,5.8 16.74,5.39 16.74,5.19 17.07,4.86 v1(17.71,4.86)
  Bottom Layer w0.254: MB1.5 4.65,11.42 5.58,10.49 5.58,5.6 9.91,1.27 14.41,1.27 17.71,4.57 v1(17.71,4.86)
MOSI: length 27.9
  Top Layer w0.254: v1(17.71,5.62) 17.02,5.62 16.33,6.31 15.55,6.31 15.44,6.42 15.23,6.42 15.15,6.51 U1.17
  Bottom Layer w0.254: v1(17.71,5.62) 17.78,5.62 18.3,5.1 18.3,4.62 14.6,0.91 9.76,0.91 5.22,5.46 5.22,8.36 4.7,8.88 MB1.6
NRST: length 29
  Top Layer w0.254: U1.15 15.07,5.42 15.44,5.42 15.65,5.21 v1(16.1,5.21)
  Bottom Layer w0.254: MB1.2 1.27,18.08 2.39,16.96 2.39,15.89 6.64,11.63 6.64,6.05 10.35,2.34 13.87,2.34 16.1,4.56 v1(16.1,5.21)
NSS: length 31.3
  Top Layer w0.254: v1(16.53,7.76) 16.44,7.66 U1.19
  Bottom Layer w0.254: MB1.3 6.29,11.48 6.29,5.9 10.21,1.98 14.12,1.98 16.74,4.61 16.74,7.55 v1(16.53,7.76)
SCK: length 30.5
  Top Layer w0.254: 14.99,7 15.27,7 15.44,7.17 16.68,7.17 16.8,7.06 17.32,7.06 v1(17.34,7.07)
  Bottom Layer w0.254: MB1.4 3.18,13.96 5.93,11.2 5.93,5.75 10.06,1.62 14.26,1.62 17.13,4.49 17.13,6.87 v1(17.34,7.07)
SX_VCC: length 3.6
  Top Layer w0.813: C5.2 v3(10.4,7.23) 10.95,7.23 10.97,7.2 11.13,7.2 ; C3.2 v3(13.59,3.02) 13.59,3.92
TX: length 17.7
  Top Layer w0.254: Q1.3 19.97,5.66 R111.1
  Top Layer w0.508: v1(19.97,10.44) Q1.3
  Bottom Layer w0.508: v1(19.97,10.44) 20.7,11.16 20.7,21.2 20.07,21.83 H1.3
$1N896: length 2.9
  Top Layer w0.254: 11.17,6 11.13,5.96 C1.2
$1N969: length 1.5
  Top Layer w0.254: R1.2 7.45,4.57 C1.1
$1N1011: length 3.8
  Top Layer w0.254: 8.29,2.28 9.6,3.58 X1.4 11.17,4.51 U1.6
$1N1017: length 0.9
  Top Layer w0.254: X1.3 8.26,3.62 R1.1
$1N1388: length 4.9
  Top Layer w0.254: C4.2 9.07,1.01 L1.2 9.96,1.97 U1.7
$1N1396: length 2.3
  Top Layer w0.254: L1.1 12.83,2.84 U1.9
$1N1923: length 4.3
  Top Layer w0.158: L2.2 10.8,10.12 C6.2 C7.2 11,8.5 U1.24
$1N2924: length 3.6
  Top Layer w0.158: C29.2 14.1,9.55 L9.2 12.83,8.29 U1.22
$1N3047: length 4.5
  Top Layer w0.158: C28.2 16.85,9.51 L9.1 13.86,8.23 13.6,8.23 13.33,7.96 U1.21
$1N4328: length 2.2
  Top Layer w0.254: LED1.2 21.15,3.62 R111.2
$1N4330: length 1.5
  Top Layer w0.254: Q1.1 18.96,6.83 R112.2
$1N8839: length 1.5
  Top Layer w0.158: R113.1 12.33,8.43 U1.23
$1N8844: length 3.5
  Top Layer w0.158: R113.2 L7.1 C24.1
$1N12166: length 3.9
  Top Layer w0.158: C26.1 11.81,14.25 C25.2 11.85,12.89 11.81,12.86 10.54,12.86
$1N12308: length 1.3
  Top Layer w0.158: L8.1 C26.2
$1N12515: length 4.5
  Top Layer w0.158: U2.6 CN1.5
$1N13592: length 4.3
  Top Layer w0.254: R114.2 15.94,22.27 15.7,22.02 15.7,21.97 15.26,21.53 15.26,21.51 15.07,21.33 C31.2 15.07,21.19 U2.5
$1N13617: length 2.6
  Top Layer w0.158: 11.68,18.44 11.68,19.88 U2.2
$1N13621: length 9.4
  Top Layer w0.158: U2.4 14.1,20 C29.1

## Copper pours and planes (outline as drawn; the poured copper is in the pictures)
GND on Top Layer: -2.67,31.99 33.91,31.99 33.91,-7.88 -2.67,-7.88
GND on Bottom Layer: -4.95,31.49 32.38,31.49 32.38,-4.58 -4.95,-4.58
GND on Inner1: 0.26,28.31 25.14,28.31 25.14,0.26 0.26,0.26
VCC on Inner2: -12.32,34.53 44.07,34.53 44.07,-3.19 -12.32,-3.19
SX_VCC on Inner2: -4.57,15.23 17.91,15.23 17.91,-12.33 -4.57,-12.33

Small or netless copper shapes (teardrops, artwork), in the pictures only: 10 on Inner1

## Text on the board
Bottom Silkscreen Layer: BUSY
Top Silkscreen Layer: VCC / SX / PWR | GND / AN / TX / 3.3V / RFS | TX | LoRa SX1262 / 1.25M / (222-225Mhz) / v0.2 | HAM
